# Altium schematic sheet RFSwitch_SKY13330-397LF.SchDoc
size A4; SheetNumber: 7; SheetTotal: 7
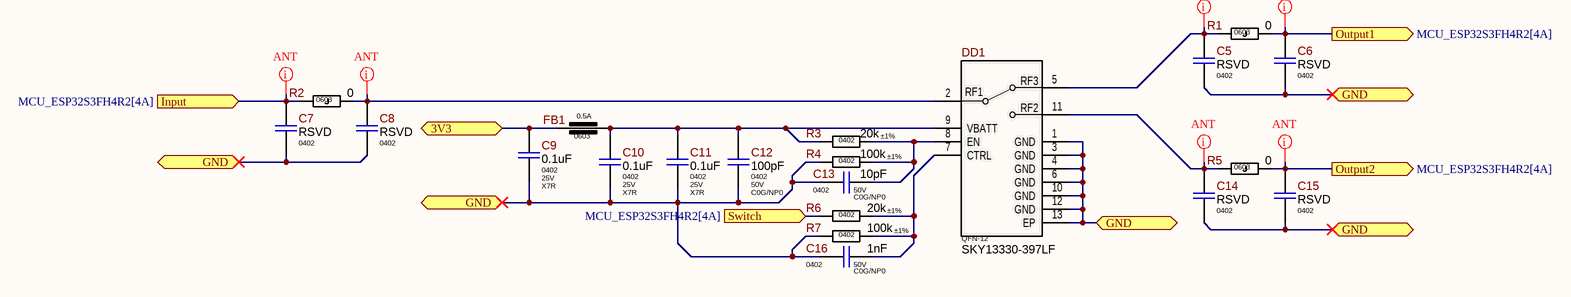
[diagram p0: RFSwitch_SKY13330-397LF.SchDoc]

## Parts
C5  Package: 0402  [C_CERAMIC_0402_MED]  (hidden comment: RSVD)  (no BOM)
C6  Package: 0402  [C_CERAMIC_0402_MED]  (hidden comment: RSVD)  (no BOM)
C7  Package: 0402  [C_CERAMIC_0402_MED]  (hidden comment: RSVD)  (no BOM)
C8  Package: 0402  [C_CERAMIC_0402_MED]  (hidden comment: RSVD)  (no BOM)
C9  Package: 0402  Voltage: 25V  Dielectric Type: X7R  [C_CERAMIC_0402_MED]  (hidden comment: 0.1uF)
C10  Package: 0402  Voltage: 25V  Dielectric Type: X7R  [C_CERAMIC_0402_MED]  (hidden comment: 0.1uF)
C11  Package: 0402  Voltage: 25V  Dielectric Type: X7R  [C_CERAMIC_0402_MED]  (hidden comment: 0.1uF)
C12  Package: 0402  Voltage: 50V  Dielectric Type: C0G/NP0  [C_CERAMIC_0402_MED]  (hidden comment: 100pF)
C13  Package: 0402  Voltage: 50V  Dielectric Type: C0G/NP0  [C_CERAMIC_0402_MED]  (hidden comment: 10pF)
C14  Package: 0402  [C_CERAMIC_0402_MED]  (hidden comment: RSVD)  (no BOM)
C15  Package: 0402  [C_CERAMIC_0402_MED]  (hidden comment: RSVD)  (no BOM)
C16  Package: 0402  Voltage: 50V  Dielectric Type: C0G/NP0  [C_CERAMIC_0402_MED]  (hidden comment: 1nF)
DD1  Package: QFN-12  [QFN-12_SKY13330-397LF]  (hidden comment: SKY13330-397LF)
FB1  Current: 0.5A  Package: 0603  [BLM18HxxxxSN1x_MED]  (hidden comment: BLM18HE152SN1D)
R1  Package: 0603  [R_ANY_CHIP_0603_MED]  (hidden comment: 0)
R2  Package: 0603  [R_ANY_CHIP_0603_MED]  (hidden comment: 0)
R3  Tolerance: ±1%  Package: 0402  [R_ANY_CHIP_0402_MED]  (hidden comment: 20k)
R4  Tolerance: ±1%  Package: 0402  [R_ANY_CHIP_0402_MED]  (hidden comment: 100k)
R5  Package: 0603  [R_ANY_CHIP_0603_MED]  (hidden comment: 0)
R6  Tolerance: ±1%  Package: 0402  [R_ANY_CHIP_0402_MED]  (hidden comment: 20k)
R7  Tolerance: ±1%  Package: 0402  [R_ANY_CHIP_0402_MED]  (hidden comment: 100k)

## Ports
3V3 (bidir, see MCU_ESP32S3FH4R2[4A], DC-DC_5V0_To_3V3[3B], MCU_ESP32S3FH4R2[1A], MCU_ESP32S3FH4R2[2C], MCU_ESP32S3FH4R2[2D], MCU_ESP32S3FH4R2[3B], MCU_ESP32S3FH4R2[4A], MCU_ESP32S3FH4R2[4C], MCU_ESP32S3FH4R2[4D], MCU_STM32L010K4T6[1A], MCU_STM32L010K4T6[1C], MCU_STM32L010K4T6[2C], MCU_STM32L010K4T6[4A], MCU_STM32L010K4T6[4B], RS-485_SN65HVD72DRBR[1B]), GND (bidir, see MCU_ESP32S3FH4R2[4A], MCU_ESP32S3FH4R2[1D], MCU_ESP32S3FH4R2[2C], MCU_ESP32S3FH4R2[3A], MCU_ESP32S3FH4R2[3B], MCU_ESP32S3FH4R2[3C], MCU_ESP32S3FH4R2[3D], MCU_ESP32S3FH4R2[4A], MCU_ESP32S3FH4R2[4B], MCU_ESP32S3FH4R2[4C], MCU_ESP32S3FH4R2[4D]), Input (in, see MCU_ESP32S3FH4R2[4A]), Output1 (out, see MCU_ESP32S3FH4R2[4A]), Output2 (out, see MCU_ESP32S3FH4R2[4A]), Switch (in, see MCU_ESP32S3FH4R2[4A])

## Nets
3V3: C9.1 FB1.2 ; port 3V3
GND: C5.2 C6.2 C7.2 C8.2 C9.2 C10.2 C11.2 C12.1 C13.1 C14.2 C15.2 C16.1 DD1.1(GND) DD1.3(GND) DD1.4(GND) DD1.6(GND) DD1.10(GND) DD1.12(GND) DD1.13(EP) R4.2 R7.1 ; port GND
Input: C7.1 R2.2 ; port Input
Output1: C6.1 R1.1 ; port Output1
Output2: C15.1 R5.1 ; port Output2
Switch: R6.1 ; port Switch
NetC5_1: C5.1 DD1.5 R1.2
NetC8_1: C8.1 DD1.2 R2.1
NetC10_1: C10.1 C11.1 C12.2 DD1.9(VBATT) FB1.1 R3.1
NetC13_2: C13.2 DD1.8(EN) R3.2 R4.1
NetC14_1: C14.1 DD1.11 R5.2
NetC16_2: C16.2 DD1.7(CTRL) R6.2 R7.2

## Layout directives
net class Anthenna: Input, NetC5_1, NetC8_1, NetC14_1, Output1, Output2

## Notes on the sheet
- (in symbol SKY13330-397LF) RF3; RF1; RF2

## Library data of the parts
C5-C8 C14 C15 = Capacitor-NonPolar: 0402 Capacitor; Part Number: GENERIC-CAP-0402; Manufacturer: NONE; Value: RSVD; Part Type: Ceramic / 0402; Component Type: SMD; Standard Lead Time: NONE; ComponentLink1URL: NONE; ComponentLink1Description: Datasheet
C9-C11 = Capacitor-NonPolar: 100nF 25V X7R ±10% 0402 Ceramic Capacitor RoHS; Part Number: GRM155R71E104KE14D; Manufacturer: Murata Electronics; Standard Lead Time: 15 Weeks; Component Status: Released; Replacement: NONE; Ajax_1С_Lifecycle: Archived; Value: 0.1uF; Part Type: Ceramic / X7R / 0402; Component Type: SMD; Temperature Range: -55°C ~ 125°C; Tolerance: ±10%; ComponentLink1URL: https://search.murata.co.jp/Ceramy/image/img/A01X/G101/ENG/GRM155R71E104KE14-01.pdf; Supplier 1: Digi-Key; Supplier Part Number 1: 490-10698-1-ND; Price: 0.005; ComponentLink1Description: Datasheet
C12 = Capacitor-NonPolar: 100pF 50V C0G ±5% 0402 Ceramic Capacitor RoHS; Part Number: CC0402JPNPO9BN101; Manufacturer: Yageo; Standard Lead Time: 12 Weeks; Component Status: Released; Replacement: NONE; Value: 100pF; Part Type: Ceramic / C0G(NP0) / 0402; Component Type: SMD; Temperature Range: -55°C ~ 125°C; Tolerance: ±5%; ComponentLink1URL: https://eu.mouser.com/datasheet/2/447/UPY_NP0X5R_01005_4V_to_25V_V10-3003057.pdf; Supplier 1: Mouser; Supplier Part Number 1: 603-CC402JPNPO9BN101; Price: 0.00092012; ComponentLink1Description: Datasheet
C13 = Capacitor-NonPolar: 10pF 50V C0G ±5% 0402 Ceramic Capacitor RoHS; Part Number: CL05C100JB5NNNC; Manufacturer: Samsung Electro-Mechanics; Standard Lead Time: 28 Weeks; Replacement: NONE; Component Status: Released; Value: 10pF; Part Type: Ceramic / C0G(NP0) / 0402; Component Type: SMD; Temperature Range: -55°C ~ 125°C; Tolerance: ±5%; ComponentLink1URL: https://media.digikey.com/pdf/Data%20Sheets/Samsung%20PDFs/CL_Series_MLCC_ds.pdf; Supplier 1: Digi-Key; Supplier Part Number 1: 1276-1139-2-ND; ComponentLink1Description: Datasheet; Price: 0.00145
C16 = Capacitor-NonPolar: 1nF 50V C0G ±5% 0402 Ceramic Capacitor RoHS; Part Number: GRM1555C1H102JA01D; Manufacturer: Murata Electronics; Standard Lead Time: 15 Weeks; Component Status: Released; Replacement: NONE; Value: 1nF; Part Type: Ceramic / C0G(NP0) / 0402; Component Type: SMD; Temperature Range: -55°C ~ 125°C; Tolerance: ±5%; ComponentLink1URL: https://search.murata.co.jp/Ceramy/image/img/A01X/G101/ENG/GRM1555C1H102JA01-01.pdf; Supplier 1: Digi-Key; Supplier Part Number 1: 490-3244-2-ND; Price: 0.00211; ComponentLink1Description: Datasheet
DD1 = SKY13330-397LF: 0.1GHz to 6.0GHz SPDT RF Switch, 0.35 dB @ 2.2 GHz Loss, 50Ohm, QFN-12 (2x2mm); Manufacturer: Skyworks Solutions; Standard Lead Time: 15 Weeks; Component Status: Released; Replacement: NONE; ComponentLink1URL: https://eu.mouser.com/datasheet/2/472/SKY13330_397LF_201407E-3365288.pdf; ComponentLink1Description: Datasheet; Part Number: SKY13330-397LF; Part Type: RF / Switch; Component Type: SMD; Temperature Range: -40°C ~ 85°C; Supplier 1: Mouser; Supplier Part Number 1: 873-SKY13330-397LF; Price: 0.4
FB1 = Ferrite-Bead: 1.5 kOhms @ 100MHz 1 Signal Line Ferrite Bead 0603, 500mA 500mOhm; Manufacturer: Murata Electronics; Saturation Current: NONE; Tolerance: ±25%; Standard Lead Time: 8 Weeks; Component Status: Released; Value: 1.5 kOhms @ 100MHz; Part Number: BLM18HE152SN1D; Part Type: Ferrite Bead; Component Type: SMD; Temperature Range: -55°C ~ 125°C; ComponentLink1URL: https://www.murata.com/en-us/products/productdata/8796741599262/ENFA0004.pdf; Supplier 1: Digi-Key; Supplier Part Number 1: 490-5216-2-ND; Replacement: NONE; Price: 0.01416; ComponentLink1Description: Datasheet
R1 R2 R5 = Resistor-J: 0 Ohms Jumper, 1/10W 0603 Thick Film Resistor; Part Number: RC0603JR-070RL; Manufacturer: Yageo; Component Status: Released; Power Rating: 0.1W; Tolerance: ±5%; Voltage: 75V; Temperature Stability: NONE; Value: 0; Component Type: SMD; Temperature Range: -55°C ~ 155°C; ComponentLink1URL: https://eu.mouser.com/datasheet/2/447/PYu_RC_Group_51_RoHS_L_10-1664068.pdf; Supplier 1: Digi-Key; Supplier Part Number 1: 311-0.0GRTR-ND; Replacement: NONE; Price: 0.0006; ComponentLink1Description: Datasheet; Part Type: Thick Film
R3 = Resistor: 20 kOhms ±1% 1/16W 0402 Thick Film Resistor; Part Number: RC0402FR-0720KL; Manufacturer: Yageo; Power Rating: 0.062W; Voltage: 50V; Temperature Stability: ±100ppm/°C; Replacement: NONE; Component Status: Released; Value: 20k; Component Type: SMD; Part Type: Thick Film; Temperature Range: -55°C ~ 155°C; ComponentLink1URL: https://eu.mouser.com/datasheet/2/447/PYu_RC_Group_51_RoHS_L_10-1664068.pdf; ComponentLink1Description: Datasheet; Price: 0.00065
R4 R7 = Resistor: 100 kOhms ±1% 1/16W 0402 Thick Film Resistor; Part Number: RC0402FR-07100KL; Manufacturer: Yageo; Power Rating: 0.062W; Voltage: 50V; Temperature Stability: ±100ppm/°C; Replacement: NONE; Component Status: Released; Value: 100k; Component Type: SMD; Temperature Range: -55°C ~ 155°C; ComponentLink1URL: https://eu.mouser.com/datasheet/2/447/PYu_RC_Group_51_RoHS_L_10-1664068.pdf; Supplier 1: Digi-Key; Supplier Part Number 1: 311-100KLRTR-ND; ComponentLink1Description: Datasheet; Part Type: Thick Film; Price: 0.00078
R6 = Resistor: 20 kOhms ±1% 1/16W 0402 Thick Film Resistor; Part Number: RC0402FR-0720KL; Manufacturer: Yageo; Power Rating: 0.062W; Voltage: 50V; Component Status: Released; Temperature Stability: ±100ppm/°C; Replacement: NONE; Value: 20k; Component Type: SMD; Part Type: Thick Film; Temperature Range: -55°C ~ 155°C; ComponentLink1URL: https://eu.mouser.com/datasheet/2/447/PYu_RC_Group_51_RoHS_L_10-1664068.pdf; Price: 0.00065; ComponentLink1Description: Datasheet